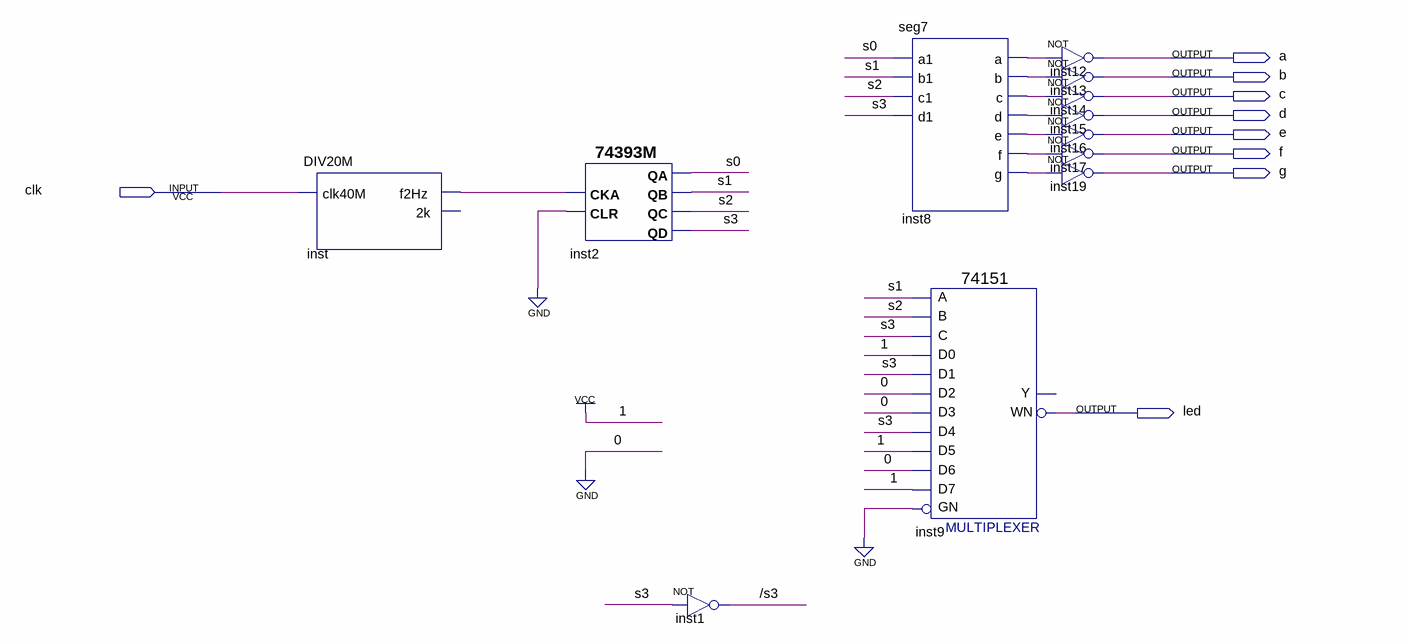
[diagram p0: schematic sheet]
// Quartus schematic P1041231.bdf as structural Verilog: 12 symbols, 9 pins
module P1041231 (
  input  clk,
  output a,
  output b,
  output c,
  output d,
  output e,
  output f,
  output g,
  output led
);

  wire \/s3 , inst8_a, inst8_b, inst8_c, inst8_d, inst8_e, inst8_f, inst8_g, inst_f2hz, s0, s1, s2, s3;

  DIV20M inst (.clk40M(clk), .f2Hz(inst_f2hz));  // open: 2k
  \74393M  inst2 (.CLR(1'b0), .CKA(inst_f2hz), .QC(s2), .QD(s3), .QB(s1), .QA(s0));
  not inst1 (\/s3 , s3);
  seg7 inst8 (
    .a1(s0), .b1(s1), .c1(s2), .d1(s3), .a(inst8_a), .b(inst8_b), .c(inst8_c), .d(inst8_d), .e(inst8_e),
    .f(inst8_f), .g(inst8_g));
  \74151  inst9 (
    .GN(1'b0), .C(s3), .B(s2), .A(s1), .D5(1'b1), .D0(1'b1), .D1(s3), .D4(s3), .D3(1'b0), .D2(1'b0),
    .D6(1'b0), .D7(1'b1), .WN(led));  // open: Y
  not inst12 (a, inst8_a);
  not inst13 (b, inst8_b);
  not inst14 (c, inst8_c);
  not inst15 (d, inst8_d);
  not inst16 (e, inst8_e);
  not inst17 (f, inst8_f);
  not inst19 (g, inst8_g);
endmodule
